# EasyEDA schematic 1-Schematic_Antenna Mini-Whip (SMD).json

## Sheets
1 Antenna Mini-Whip (SMD): Main module: TITLE: Antenna Mini-Whip (SMD): Main module; REV: 3.7.EE; Date: 2018-05-21; Sheet: 1/2; Drawn By: IgrikXD
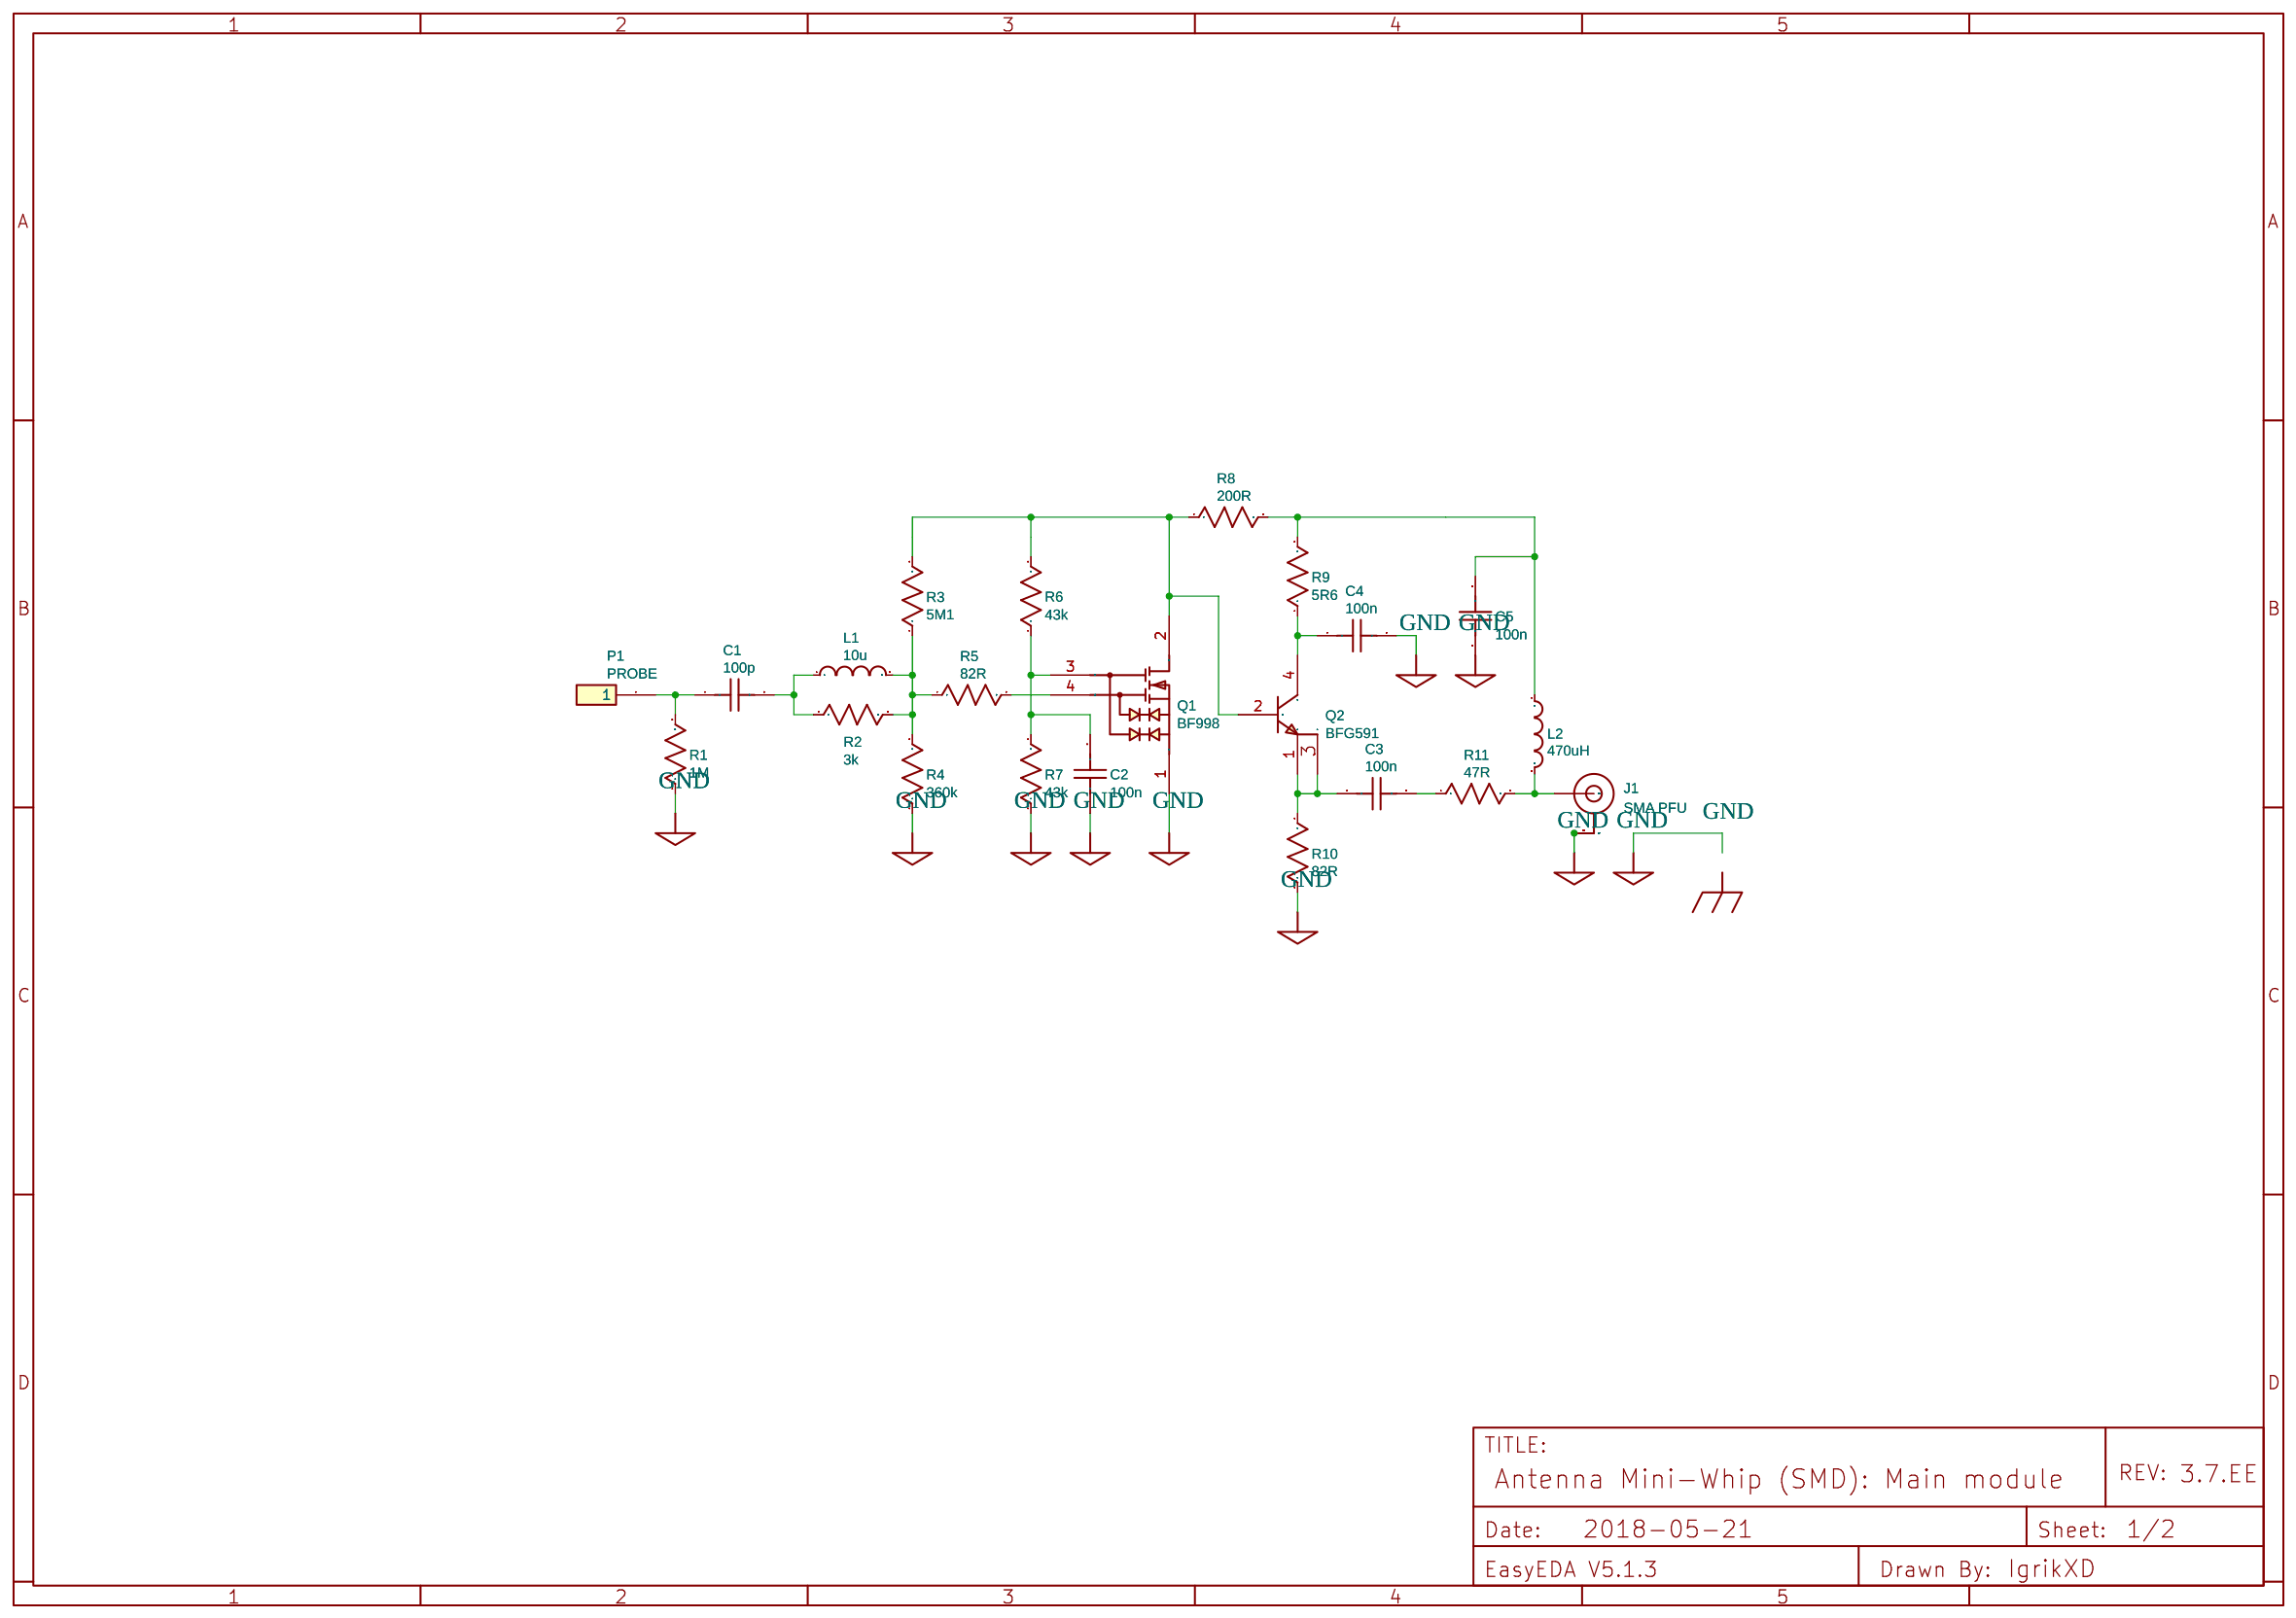
[diagram p0: Antenna Mini-Whip (SMD): Main module]
2 Antenna Mini-Whip (SMD): Power feed unit: TITLE: Antenna Mini-Whip (SMD): Power feed unit; Sheet: 2/2
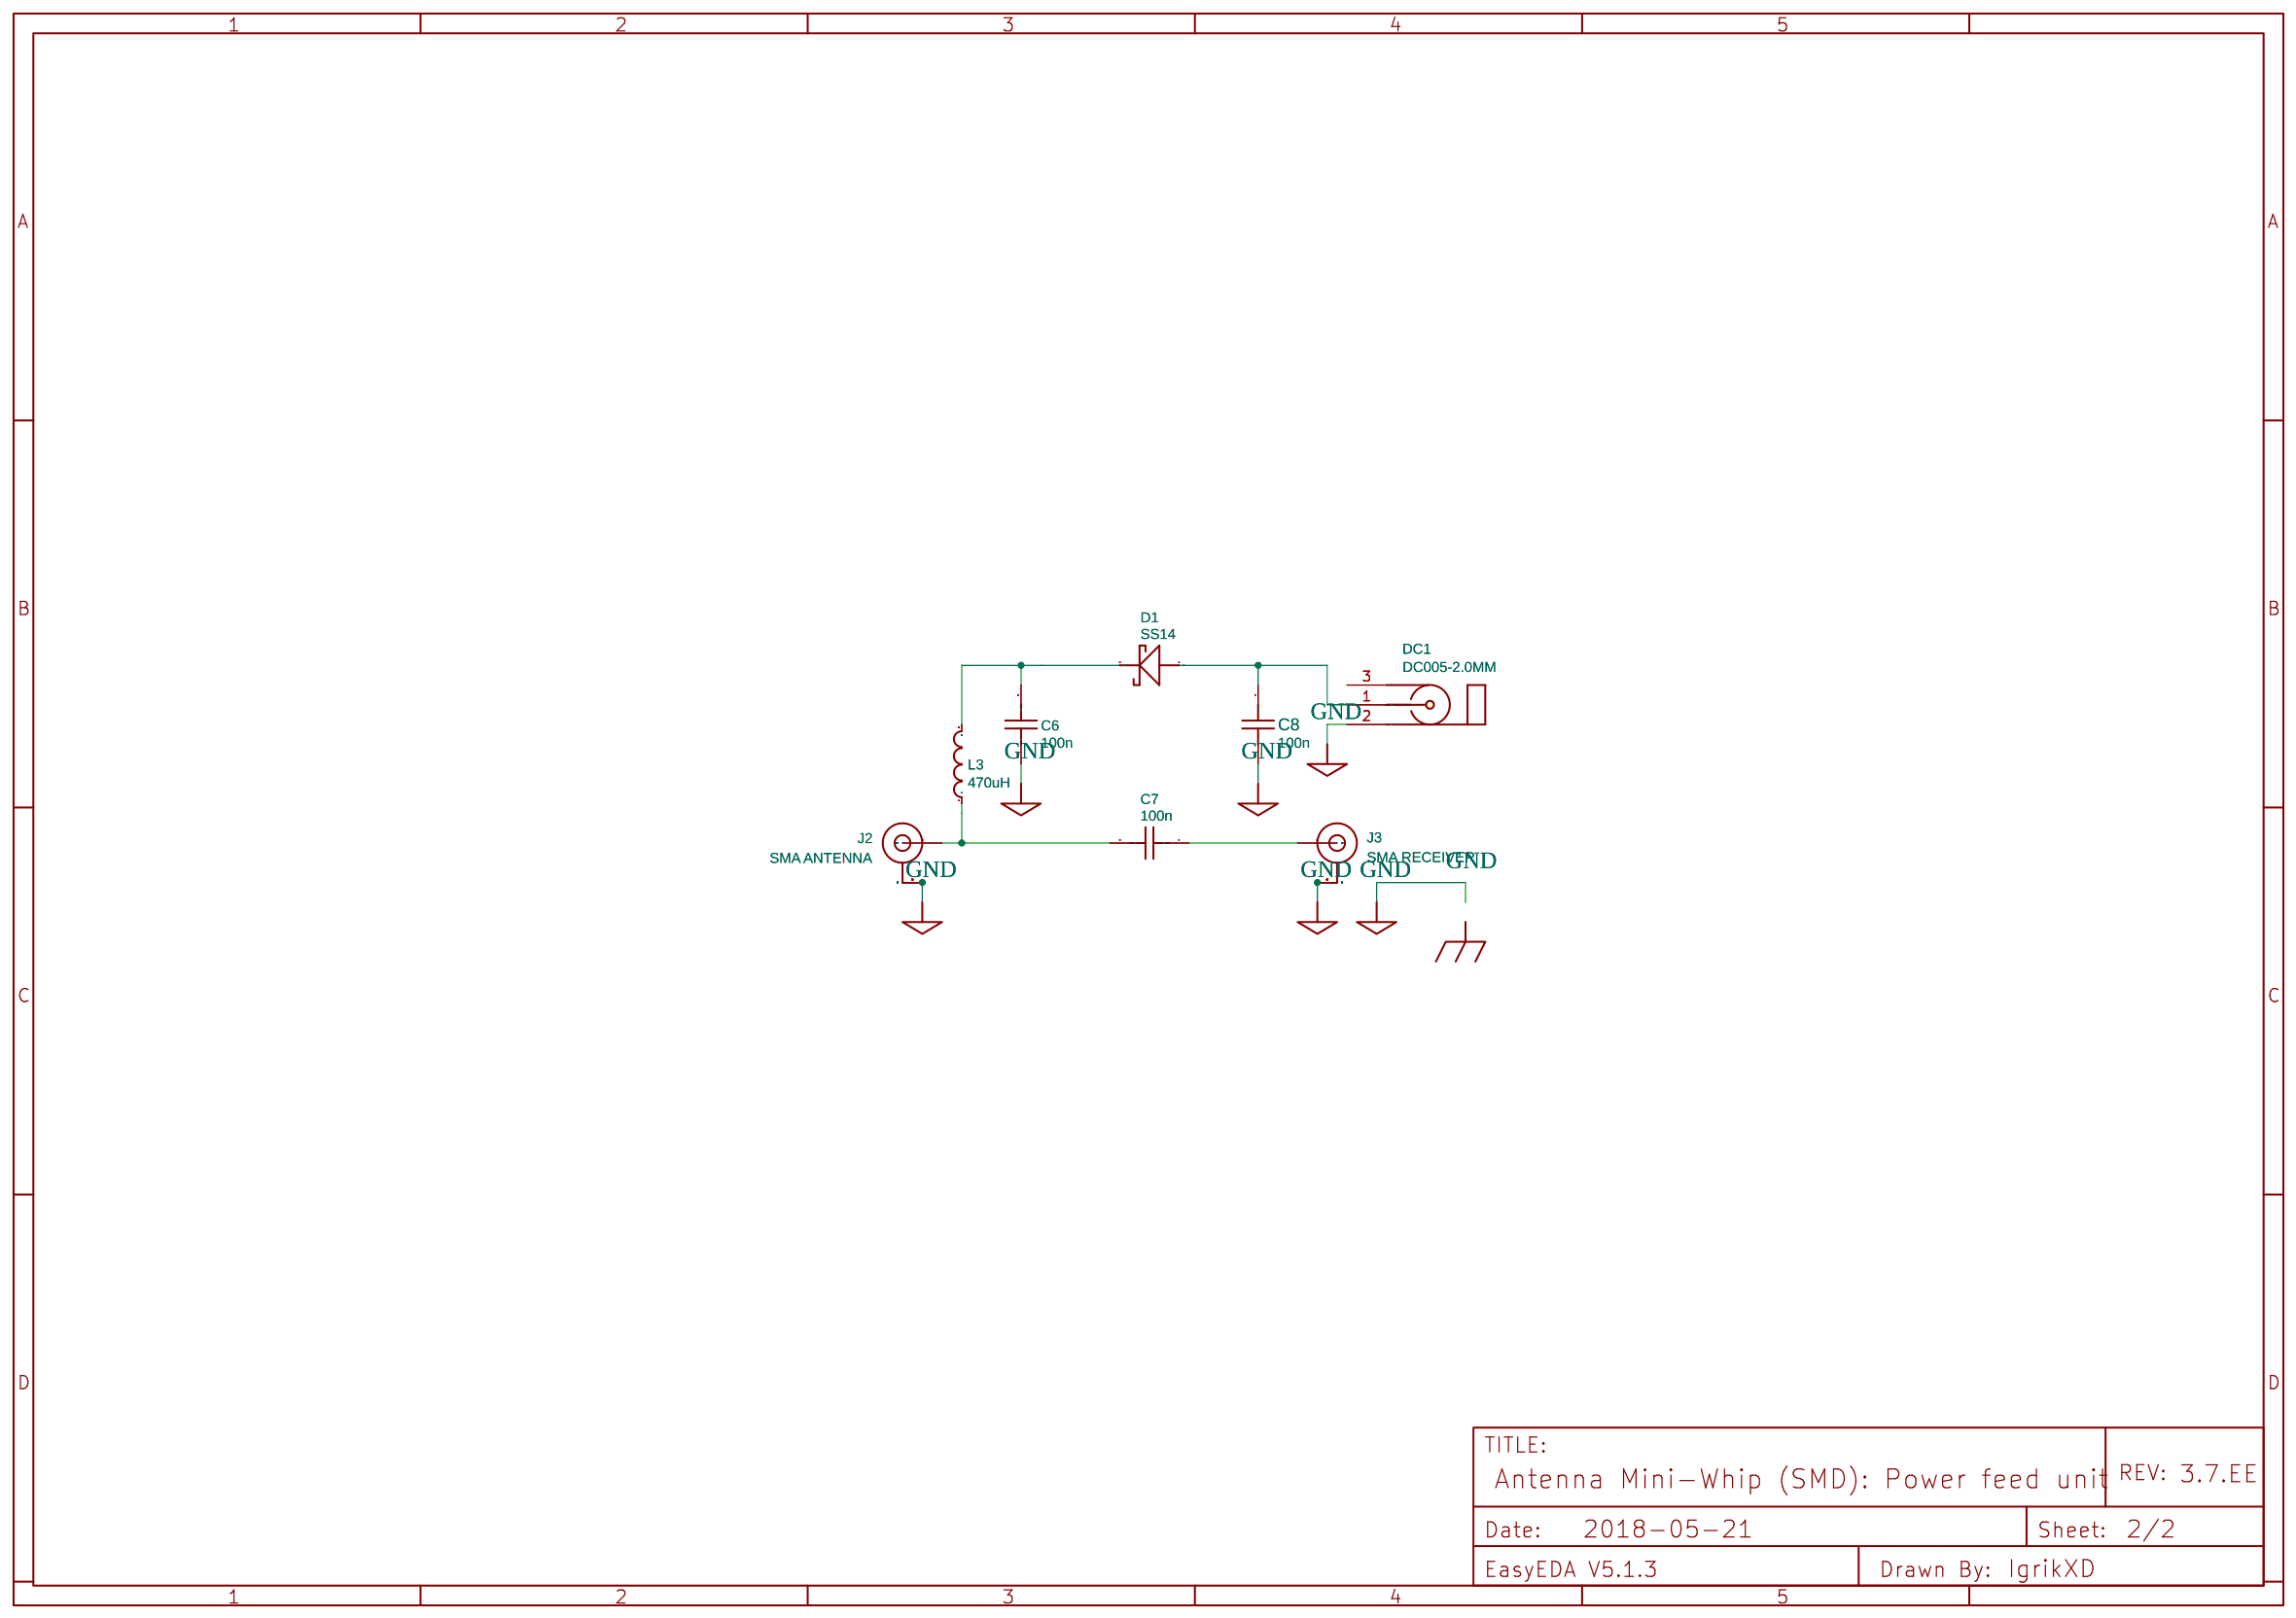
[diagram p1: Antenna Mini-Whip (SMD): Power feed unit]

## Parts
sheet Antenna Mini-Whip (SMD): Main module
C1  100p  [0805]
C2  100n  [0805]
C3  100n  [0805]
C4  100n  [0805]
C5  100n  [0805]
J1  SMA PFU  [SMA-EDGE]
L1  10u  [0805]
L2  470uH  [7850]
P1  PROBE  [HDR-1X1/2.54]
Q1  BF998  [SOT143]
Q2  BFG591  [SOT-223]
R1  1M  [0805]
R2  3k  [0805]
R3  5M1  [0805]
R4  360k  [0805]
R5  82R  [0805]
R6  43k  [0805]
R7  43k  [0805]
R8  200R  [1206]
R9  5R6  [0805]
R10  82R  [2512]
R11  47R  [0805]
sheet Antenna Mini-Whip (SMD): Power feed unit
C6  100n  [0805]
C7  100n  [0805]
C8  100n  [0805]
D1  SS14  [DO214AC]
DC1  DC005-2.0MM  [DC-5020]
J2  SMA ANTENNA  [SMA-EDGE]
J3  SMA RECEIVER  [SMA-EDGE]
L3  470uH  [7850]

## Library data of the parts
C1 = Capacitor: Manufacturer Part: CC0805JRNPOBBN101; Supplier: LCSC; LCSC: C107122; Manufacturer: YAGEO
C2-C8 = Capacitor: Manufacturer Part: 08055C104JAT2A; Supplier: LCSC; LCSC: C129175; Manufacturer: AVX
J1-J3 = -: catid: 20; Contributor: Pinoccio; Manufacturer Part: ANKX01.0093; Supplier: LCSC; Manufacturer: RFsister; LCSC: C129604
L1 = Inductor: Manufacturer Part: MLF2012E100JT000; Supplier: LCSC; LCSC: C76742; Manufacturer: TDK
L2 L3 = -: Supplier: LCSC; Manufacturer: SXN; Manufacturer Part: SM7850-471MT; LCSC: C10158
P1 = -: LCSC: C81276; Supplier: LCSC; Manufacturer: LCSC; Manufacturer Part: Header-Male-2.54_1x1; Mounted: No
Q1 = -: Silicon N-channel Dual-gate MOSFET; catid: 20; Manufacturer Part: BF998E6327HTSA1; Supplier: LCSC; LCSC: C108141; Manufacturer: Infineon
Q2 = -: catid: 20; Manufacturer Part: BFG591,115; Supplier: Digi-Key; Digi-Key: 568-1985-2-ND; Manufacturer: NXP USA Inc.
R1 = Resistor: Manufacturer Part: RC0805FR-071ML; Supplier: LCSC; LCSC: C107700; Manufacturer: YAGEO
R2 = Resistor: Manufacturer Part: RC0805FR-073KL; Supplier: LCSC; LCSC: C126350; Manufacturer: YAGEO
R3 = Resistor: Manufacturer Part: RC0805FR-075M1L; Supplier: LCSC; LCSC: C137506; Manufacturer: YAGEO
R4 = Resistor: Manufacturer Part: RC0805FR-07360KL; Supplier: LCSC; LCSC: C137539; Manufacturer: YAGEO
R5 = Resistor: Manufacturer Part: RTT0582R0FTP; Supplier: LCSC; LCSC: C104532; Manufacturer: RALEC
R6 R7 = Resistor: Manufacturer Part: RTT054302FTP; Supplier: LCSC; LCSC: C104317; Manufacturer: RALEC
R8 = Resistor: Manufacturer Part: RC1206FR-07200RL; Supplier: LCSC; LCSC: C114939; Manufacturer: YAGEO
R9 = Resistor: Manufacturer Part: CR0805F85R60G; Supplier: LCSC; LCSC: C101807; Manufacturer: LIZ
R10 = Resistor: Manufacturer Part: CR2512J82RE042W; Supplier: LCSC; LCSC: C175438; Manufacturer: Ever Ohms Tech
R11 = Resistor: Manufacturer Part: RTT0547R0FTP; Supplier: LCSC; LCSC: C104358; Manufacturer: RALEC
D1 = -: Contributor: SparkFun; Manufacturer Part: SS14D; Supplier: LCSC; LCSC: C83912; Manufacturer: Semtech
DC1 = -: Supplier: LCSC; Manufacturer: BOOMELE; Manufacturer Part: DC-005 5.5-2.0MM; LCSC: C16214

## Nets
GND: C2.1 C4.2 C5.1 C6.1 C8.1 DC1.2 J1.GND@0(GND) J1.GND@1(GND) J1.GND@2(GND) J1.GND@3(GND) J2.GND@0(GND) J2.GND@1(GND) J2.GND@2(GND) J2.GND@3(GND) J3.GND@0(GND) J3.GND@1(GND) J3.GND@2(GND) J3.GND@3(GND) Q1.1(S) R1.1 R4.1 R7.1 R10.1
Net-(C1-1): C1.1 P1.1 R1.2
Net-(C1-2): C1.2 L1.1 R2.1
Net-(C2-2): C2.2 Q1.3(G2) R6.1 R7.2
Net-(C3-1): C3.1 Q2.1(E) Q2.3(E) R10.2
Net-(C3-2): C3.2 R11.1
Net-(C4-1): C4.1 Q2.4(C) R9.1
Net-(C5-2): C5.2 L2.1 R8.2 R9.2
Net-(C6-2): C6.2 D1.2(C) L3.2
Net-(C7-1): C7.1 J3.SIG(SIGNAL)
Net-(C7-2): C7.2 J2.SIG(SIGNAL) L3.1
Net-(C8-2): C8.2 D1.1(A) DC1.1(VCC)
Net-(J1-SIG): J1.SIG(SIGNAL) L2.2 R11.2
Net-(L1-2): L1.2 R2.2 R3.1 R4.2 R5.1
Net-(Q1-2): Q1.2(D) Q2.2(B) R3.2 R6.2 R8.1
Net-(Q1-4): Q1.4(G1) R5.2

Not connected (* = marked no-connect by the designer): DC1 3
